# Altium project MAIN BOARD CERES.PrjPcb (part 1 of 2)
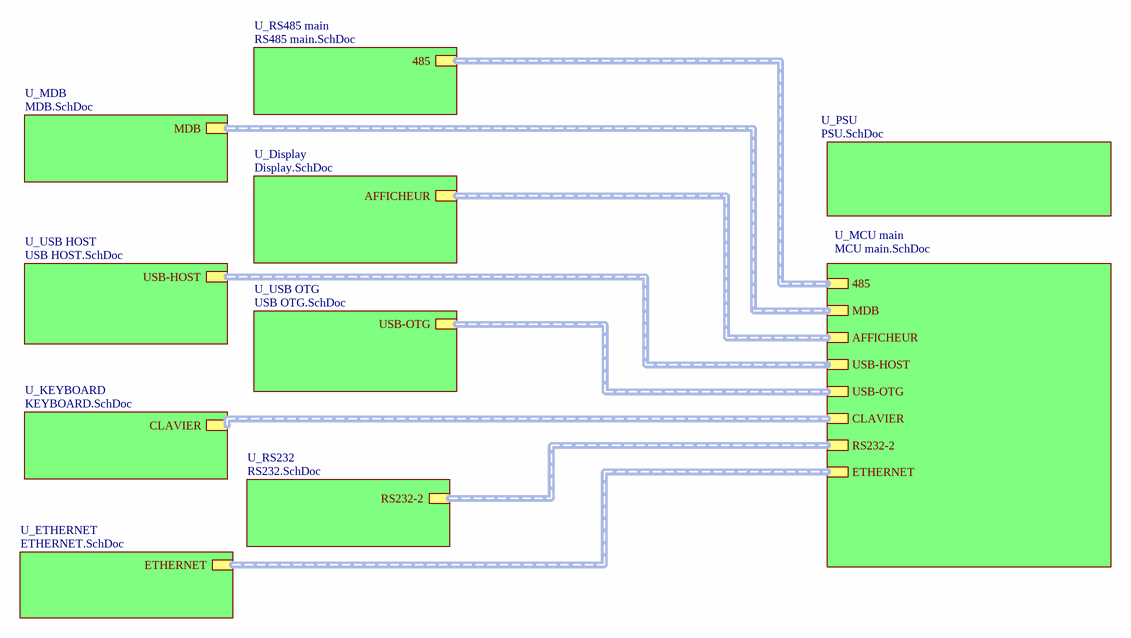
[diagram p0: TOPSHEET.SchDoc]
DrawnBy: Rachid AKKOUCHE; Telephone: +33651604047
11 sheets, 187 parts. Net scope: hierarchical (ports join the sheet entries above them; power ports are global).
Board file: MAIN BOARD CERESV2.PCBDOC
Sheets:
  TOPSHEET.SchDoc
    U_RS485 main = RS485 main.SchDoc
    U_MDB = MDB.SchDoc
    U_KEYBOARD = KEYBOARD.SchDoc
    U_RS232 = RS232.SchDoc
    U_PSU = PSU.SchDoc
    U_USB HOST = USB HOST.SchDoc
    U_USB OTG = USB OTG.SchDoc
    U_Display = Display.SchDoc
    U_MCU main = MCU main.SchDoc
    U_ETHERNET = ETHERNET.SchDoc

## Sheet TOPSHEET.SchDoc: TOP SHEET
size A4; Date: 30 08 2013; Author: Rachid AKKOUCHE; CompanyName: RASoftware; Organization: RASoftware; Address1: 52 J03, rue de la crèche; Address2: 77100 MEAUX; Address3: FRANCE; DocumentNumber: BRA201308301C; Revision: C; SheetNumber: 1; SheetTotal: 11; Telephone: +33651604047; Email: rachid.akkouche@wanadoo.fr; Proprietaire: MDI; Dessinepar: Rachid AKKOUCHE; Verifiepar: -; Time: 19:00

### Sub-sheets
U_Display = Display.SchDoc: AFFICHEUR (harness IO DISPLAY)
U_ETHERNET = ETHERNET.SchDoc: ETHERNET (harness ETHERNET)
U_KEYBOARD = KEYBOARD.SchDoc: CLAVIER (harness KEYBOARD)
U_MCU main = MCU main.SchDoc: USB-HOST (harness USB-HOST), USB-OTG (harness USG-OTG), RS232-2 (harness RS232_2), ETHERNET (harness ETHERNET), AFFICHEUR (harness IO DISPLAY), CLAVIER (harness KEYBOARD), 485 (harness EIA-485), MDB (harness MDB)
U_MDB = MDB.SchDoc: MDB (harness MDB)
U_PSU = PSU.SchDoc: no entries
U_RS232 = RS232.SchDoc: RS232-2 (harness RS232_2)
U_RS485 main = RS485 main.SchDoc: 485 (harness EIA-485)
U_USB HOST = USB HOST.SchDoc: USB-HOST (harness USB-HOST)
U_USB OTG = USB OTG.SchDoc: USB-OTG (harness USG-OTG)

### Buses and harness runs
harness sheet U_Display/AFFICHEUR = sheet U_MCU main/AFFICHEUR
harness sheet U_ETHERNET/ETHERNET = sheet U_MCU main/ETHERNET
harness sheet U_KEYBOARD/CLAVIER = sheet U_MCU main/CLAVIER
harness sheet U_MCU main/485 = sheet U_RS485 main/485
harness sheet U_MCU main/MDB = sheet U_MDB/MDB
harness sheet U_MCU main/RS232-2 = sheet U_RS232/RS232-2
harness sheet U_MCU main/USB-HOST = sheet U_USB HOST/USB-HOST
harness sheet U_MCU main/USB-OTG = sheet U_USB OTG/USB-OTG

### Notes on the sheet
- Ce document est la propriété de
- Project:
- Il ne peut être divulgué sans l'accord écrit de l'un de ses représentants dûment mandaté
- Title:
- Number:
- Date:
- Time:
- Size:
- A4
- Revision:
- Sheet
- of
- 52 J03 rue de la crèche
- Draw by:
- 77100 Meaux

## Sheet RS485 main.SchDoc: RS 485
size A4; Date: 30 08 2013; Author: Rachid AKKOUCHE; CompanyName: MDI; DrawnBy: Rachid AKKOUCHE; Organization: RASoftware; Address1: 52 J03, rue de la crèche; Address2: 77100 MEAUX; Address3: FRANCE; DocumentNumber: BRA201308304C; Revision: C; SheetNumber: 4; SheetTotal: 11; Telephone: +33651604047; Email: rachid.akkouche@wanadoo.fr; Proprietaire: MDI System; Dessinepar: -; Verifiepar: -; Time: 19:00
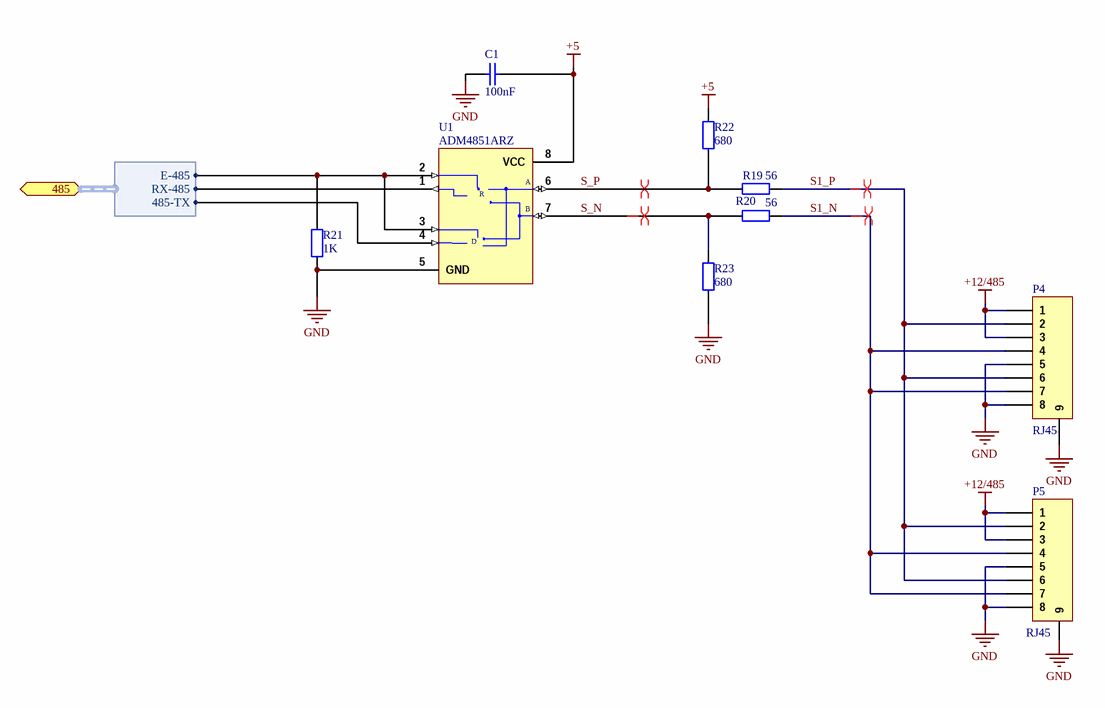
[diagram p1: RS485 main.SchDoc]

### Parts
C1  100nF  [C0805]
P4  RJ45  [MOLEX-RJ45_855135013]
P5  RJ45  [MOLEX-RJ45_855135013]
R19  56  [R0805]
R20  56  [R0805]
R21  1K  [R0805]
R22  680  [R0805]
R23  680  [R0805]
U1  ADM4851ARZ  [SOIC8]

### Ports
485 (harness EIA-485)

### Harnesses
EIA-485: 485-TX, RX-485, E-485

### Nets
+5: C1.1 R22.2 U1.8(VCC)
+12/485: P4.1 P4.3 P5.1 P5.3
GND: C1.2 P4.5 P4.8 P4.9 P5.5 P5.8 R21.1 R23.1 U1.5(GND)
S1_N: P4.4 P4.7 P5.4 P5.7 R20.2  [project net S1_N_4]
S1_P: P4.2 P4.6 P5.2 P5.6 R19.2  [project net S1_P_4]
S_N: R20.1 R23.2 U1.7(B)  [project net S_N_4]
S_P: R19.1 R22.1 U1.6(A)  [project net S_P_4]
NetR21_2: R21.2 U1.2(~{RE}) U1.3(DE) ; port 485.E-485
NetU1_1: U1.1(RO) ; port 485.RX-485
NetU1_4: U1.4(DI) ; port 485.485-TX

Not connected (* = marked no-connect by the designer): P5 9

### Layout directives
differential pair: S1_N_4, S1_P_4, S_N_4, S_P_4

### Notes on the sheet
- Labels drawn without touching a wire or pin: GND
- Ce document est la propriété de
- Project:
- Il ne peut être divulgué sans l'accord écrit de l'un de ses représentants dûment mandaté
- Title:
- Number:
- Date:
- Time:
- Size:
- A4
- Revision:
- Sheet
- of
- 52 J03 rue de la crèche
- Draw by:
- 77100 Meaux
- (in symbol MAX485ESA) R; D

### Library data of the parts
C1 = Cap 0805 100nF: Capacitor; Manufacturer: MULTICOMP; Manufacturer Part Number: MCCA000296; Supplier 1: Farnell; Supplier Part Number 1: 1759167; Pricing 1: 100=0,01, 500=0,008, 1000=0,006, 4000=0,005 (EUR); ComponentLink1URL: http://www.farnell.com/datasheets/1520827.pdf; ComponentLink1Description: http://www.farnell.com/datasheets/1520827.pdf
P4 P5 = Header 8: Header, 8-Pin; Manufacturer: MOLEX; Manufacturer Part Number: 85513-5013; Genre: Embase; Nombre de contacts: 8; Nombre de ports: 1; Catégorie LAN: Cat3; Terminaison du contact: Montage en surface vertical; Plaquage du contact: Or; Matériau du contact: Bronze phosphoreux; Approval Category: UL 94V-0; Couleur: Black; Courant: 1.5; Force diélectrique, Vca: 1000; Inflammabilité: UL94V-0; Largeur (externe): 15.9; Longueur/hauteur: 13; Matière: Glass Filled LCP; Profondeur: 18.8; Résistance d'isolement: 500; Résistance, contact: 20; Température de fonctionnement max..: 80; Température d'utilisation min: -40; Tension c.a.: 125; Supplier 1: Farnell; Supplier Part Number 1: 1345055; RoHS: YES; Pricing 1: 1=0,98, 10=0,92, 50=0,86, 100=0,74 (EUR); Type de connecteur: RJ45; Nombre de positions: 8; Body Plating: Or; Nombre de voies: 8; ComponentLink1URL: http://www.farnell.com/cad/1734187.pdf; ComponentLink1Description: http://www.farnell.com/cad/1734187.pdf; ComponentLink2URL: http://www.farnell.com/datasheets/1733622.pdf; ComponentLink2Description: http://www.farnell.com/datasheets/1733622.pdf
R19 R20 = Resistor 0805 56: Resistor; Manufacturer: MULTICOMP; Manufacturer Part Number: MC01W0805156R; Product Range: MULTICOMP - MC Series; Puissance: 100; Tolérance de résistance: ± 1%; Type de boîtier de résistance: 0805; Type de résistance: Couche épaisse; Coefficient de température: ± 200; Tension: 150; Type de packaging: Full Reel; SVHC: No SVHC (20-Jun-2013); Resistor Mounting: CMS; Supplier 1: Farnell; RoHS: YES; Pricing 1: 5000=0,001 (EUR); Résistance: 56; MSL: (Non Applicable); ComponentLink1URL: http://www.farnell.com/datasheets/1729047.pdf; ComponentLink1Description: http://www.farnell.com/datasheets/1729047.pdf; Supplier Part Number 1: 2129016
R21 = Resistor 0805 1K: Resistor; Manufacturer: MULTICOMP; Manufacturer Part Number: MC0.1W08051%1KFR; Product Range: MULTICOMP - MC Series; Résistance: 1; Puissance: 100; Tolérance de résistance: ± 1%; Type de boîtier de résistance: 0805; Type de résistance: Couche épaisse; Coefficient de température: ± 100; Tension: 150; Type de packaging: Full Reel; Resistor Mounting: CMS; Supplier 1: Farnell; RoHS: YES; Pricing 1: 5000=0,001 (EUR); MSL: MSL 1 - Illimité; ComponentLink1URL: http://www.farnell.com/datasheets/1716700.pdf; ComponentLink1Description: http://www.farnell.com/datasheets/1716700.pdf; Supplier Part Number 1: 2129113
R22 R23 = Resistor 0805 680: Resistor; Manufacturer: MULTICOMP; Manufacturer Part Number: MC01W08051680R; Supplier 1: Farnell; RoHS: YES; Pricing 1: 5000=0,001 (EUR); ComponentLink1URL: http://www.farnell.com/datasheets/1729047.pdf; ComponentLink1Description: http://www.farnell.com/datasheets/1729047.pdf; Supplier Part Number 1: 2129101
U1 = MAX485ESA: Low-Power, Slew-Rate-Limited RS-485/RS-422 Transceiver; Manufacturer: ANALOG DEVICES; Type de driver: Émetteur-récepteur de ligne différentiel; Type d'interface CI: RS422, RS485; Nombre de drivers: 1; Tension, alimentation min.: 4.75; Tension, alimentation max..: 5.25; Type de boîtier CI Driver: NSOIC; Nombre de broches: 8; Température d'utilisation min: -40; Température de fonctionnement max..: 85; SVHC: No SVHC (20-Jun-2013); Supplier 1: Farnell; Supplier Part Number 1: 2313594; Manufacturer Part Number: ADM4851ARZ; RoHS: YES; Pricing 1: 1=1,39, 10=1,13, 100=1,01, 250=0,9, 500=0,79 (EUR); MSL: MSL 1 - Illimité; ComponentLink1URL: http://www.analog.com/static/imported-files/data_sheets/ADM4850_4851_4852_4853_4854_4855_4856_4857.pdf; ComponentLink1Description: http://www.analog.com/static/imported-files/data_sheets/ADM4850_4851_4852_4853_4854_4855_4856_4857.pdf; ComponentLink2URL: http://www.farnell.com/cad/1713403.zip; ComponentLink2Description: http://www.farnell.com/cad/1713403.zip

## Sheet MDB.SchDoc: MDB
size A4; Date: 30 08 2013; Author: Rachid AKKOUCHE; CompanyName: MDI; DrawnBy: Rachid AKKOUCHE; Organization: RASoftware; Address1: 52 J03, rue de la crèche; Address2: 77100 MEAUX; Address3: FRANCE; DocumentNumber: BRA201308303C; Revision: C; SheetNumber: 3; SheetTotal: 11; Telephone: +33651604047; Email: rachid.akkouche@wanadoo.fr; Proprietaire: MDI System; Dessinepar: -; Verifiepar: -; Time: 19:00
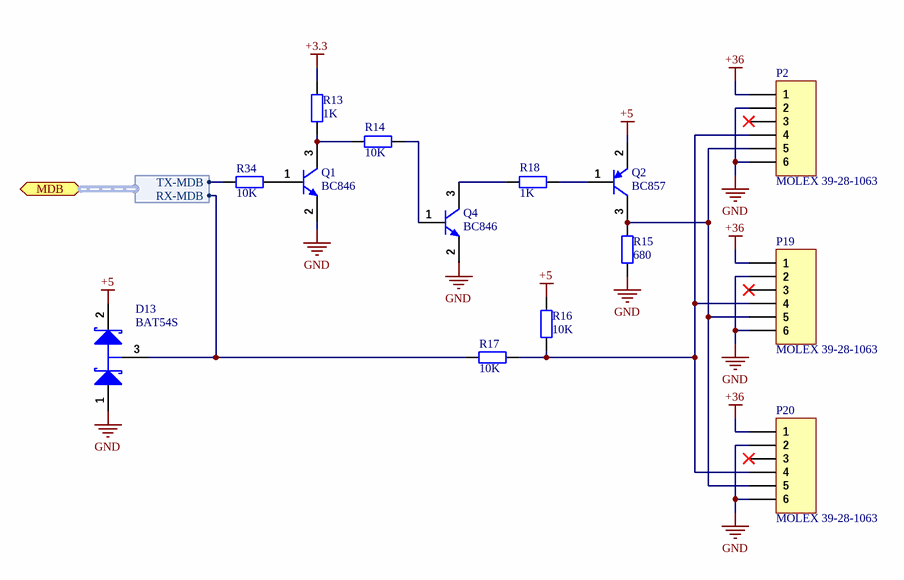
[diagram p2: MDB.SchDoc]

### Parts
D13  BAT54S  [SOT23]
P2  MOLEX 39-28-1063  [MOLEX 39-28-1063]
P19  MOLEX 39-28-1063  [MOLEX 39-28-1063]
P20  MOLEX 39-28-1063  [MOLEX 39-28-1063]
Q1  BC846  [SOT-23]
Q2  BC857  [SOT-23]
Q4  BC846  [SOT-23]
R13  1K  [R0805]
R14  10K  [R0805]
R15  680  [R0805]
R16  10K  [R0805]
R17  10K  [R0805]
R18  1K  [R0805]
R34  10K  [R0805]

### Ports
MDB (harness MDB)

### Harnesses
MDB: TX-MDB, RX-MDB

### Nets
+3.3: R13.2
+5: D13.2(K) Q2.2(E) R16.2
+36: P2.1 P19.1 P20.1
GND: D13.1(A) P2.2 P2.6 P19.2 P19.6 P20.2 P20.6 Q1.2(E) Q4.2(E) R15.1
NetD13_3: D13.3(C) R17.2 ; port MDB.RX-MDB
NetP2_4: P2.4 P19.4 P20.4 R16.1 R17.1
NetP2_5: P2.5 P19.5 P20.5 Q2.3(C) R15.2
NetQ1_1: Q1.1(B) R34.1
NetQ1_3: Q1.3(C) R13.1 R14.2
NetQ2_1: Q2.1(B) R18.1
NetQ4_1: Q4.1(B) R14.1
NetQ4_3: Q4.3(C) R18.2
NetR34_2: R34.2 ; port MDB.TX-MDB

Not connected (* = marked no-connect by the designer): P2 3*; P19 3*; P20 3*

### Notes on the sheet
- Ce document est la propriété de
- Project:
- Il ne peut être divulgué sans l'accord écrit de l'un de ses représentants dûment mandaté
- Title:
- Number:
- Date:
- Time:
- Size:
- A4
- Revision:
- Sheet
- of
- 52 J03 rue de la crèche
- Draw by:
- 77100 Meaux

### Library data of the parts
D13 = BAT54S: Schottky Barrier Double Diode; Manufacturer: MULTICOMP; Courant, If moy.: 200; Tension, Vrrm: 30; Tension, Vf max..: 400; Temps trr max.: 5; Courant, Ifs max.: 600; Type de boîtier diode: SOT-23; Nombre de broches: 3; SVHC: No SVHC (19-Dec-2012); Configuration diode: Dual Series; Température, Tj max..: 150; Type de terminaison: SMD; Température d'utilisation min: -55; Courant, If, Vf: 10; Courant, Ir, max..: 2; Marquage, CMS: L44; Température de fonctionnement: -55°C à +150; Supplier 1: Farnell; Supplier Part Number 1: 1621835; Manufacturer Part Number: BAT54S; RoHS: YES; Stock 1: 52055; Pricing 1: 10=0,102, 250=0,074, 1000=0,06, 3000=0,053 (EUR); Diode Type: Schottky; Type de boîtier: SOT-23; courant Ifsm: 600; ComponentLink1URL: http://www.farnell.com/datasheets/1317753.pdf; ComponentLink1Description: http://www.farnell.com/datasheets/1317753.pdf; Température de fonctionnement max..: 150
P2 P19 P20 = Header 6: Connecteur MDB; Supplier 1: Farnell; Supplier Part Number 1: 9732101; Manufacturer: MOLEX; Manufacturer Part Number: 39-28-1063; RoHS: YES; Pricing 1: 1=0,66, 100=0,62, 250=0,58, 500=0,52, 1000=0,46 (EUR); ComponentLink1URL: http://www.molex.com/pdm_docs/sd/039310028_sd.pdf; ComponentLink1Description: http://www.molex.com/pdm_docs/sd/039310028_sd.pdf; ComponentLink2URL: http://www.youtube.com/watch?v=pjOsgpqyzYE; ComponentLink2Description: http://www.youtube.com/watch?v=pjOsgpqyzYE; ComponentLink3URL: http://www.farnell.com/datasheets/1729684.pdf; ComponentLink3Description: http://www.farnell.com/datasheets/1729684.pdf
Q1 Q4 = BC846B: NPN General-purpose Transistor; Manufacturer: NXP; Tension, Vceo: 65; Dissipation de puissance Pd: 250; Courant de collecteur DC: 100; Gain en courant DC hFE: 110; Température d'utilisation min: -65; Température de fonctionnement max..: 150; Nombre de broches: 3; SVHC: No SVHC (19-Dec-2012); Courant, Ic (hfe): 2; FB max..: 10; Gain Bande-passante ft, typ.: 300; Hfe, typ.: 125; Marquage, CMS: 1; Température de fonctionnement: -65°C à +150; Tension, Vcbo: 80; Tension, Vce sat max..: 200; Type de terminaison: SMD; Supplier 1: Farnell; Supplier Part Number 1: 1081227; Manufacturer Part Number: BC846; RoHS: YES; Pricing 1: 10=0,02, 100=0,016, 1000=0,015, 3000=0,013 (EUR); Polarité transistor: NPN; Type de boîtier de transistor: SOT-23; Courant Ic max..: 100; Courant, Ic max.. permanent a: 100; Hfe, min.: 110; Marquage composant: BC846; Nombre de transistors: 1; Puissance, Ptot: 250; Type de boîtier: SOT-23; ft, min.: 100; ComponentLink1URL: http://www.farnell.com/datasheets/1581369.pdf; ComponentLink1Description: http://www.farnell.com/datasheets/1581369.pdf
Q2 = PMBT2907A: PNP Switching Transistor; Manufacturer: NXP; Supplier 1: Farnell; Supplier Part Number 1: 1081244; Manufacturer Part Number: BC857; RoHS: YES; Stock 1: 28017; Pricing 1: 10=0,023, 100=0,021, 1000=0,019, 3000=0,017 (EUR); ComponentLink1URL: http://www.nxp.com/documents/data_sheet/BC856_BC857_BC858.pdf; ComponentLink1Description: http://www.nxp.com/documents/data_sheet/BC856_BC857_BC858.pdf
R13 R18 = Resistor 0805 1K: as R21 on sheet RS485 main; Supplier 1: Farnell; RoHS: YES; Pricing 1: 5000=0,001 (EUR); MSL: MSL 1 - Illimité; ComponentLink1URL: http://www.farnell.com/datasheets/1716700.pdf; ComponentLink1Description: http://www.farnell.com/datasheets/1716700.pdf; Supplier Part Number 1: 2129113
R14 R16 R17 R34 = Resistor 0805 10K: Resistor; Manufacturer: MULTICOMP; Manufacturer Part Number: MC0.1W08051%10KFR; Product Range: MULTICOMP - MC Series; Résistance: 10; Puissance: 100; Tolérance de résistance: ± 1%; Type de boîtier de résistance: 0805; Type de résistance: Couche épaisse; Coefficient de température: ± 100; Tension: 150; Type de packaging: Full Reel; Resistor Mounting: CMS; Supplier 1: Farnell; RoHS: YES; Pricing 1: 5000=0,001 (EUR); MSL: MSL 1 - Illimité; ComponentLink1URL: http://www.farnell.com/datasheets/1716700.pdf; ComponentLink1Description: http://www.farnell.com/datasheets/1716700.pdf; Supplier Part Number 1: 2129195
R15 = Resistor 0805 680: as R22 on sheet RS485 main; Supplier 1: Farnell; RoHS: YES; Pricing 1: 5000=0,001 (EUR); ComponentLink1URL: http://www.farnell.com/datasheets/1729047.pdf; ComponentLink1Description: http://www.farnell.com/datasheets/1729047.pdf; Supplier Part Number 1: 2129101

## Sheet KEYBOARD.SchDoc: KEYBOARD
size A4; Date: 30 08 2013; Author: Rachid AKKOUCHE; CompanyName: MDI; DrawnBy: Rachid AKKOUCHE; Organization: RASoftware; Address1: 52 J03, rue de la crèche; Address2: 77100 MEAUX; Address3: FRANCE; DocumentNumber: BRA201308306C; Revision: C; SheetNumber: 6; SheetTotal: 11; Telephone: +33651604047; Email: rachid.akkouche@wanadoo.fr; Proprietaire: MDI System; Dessinepar: -; Verifiepar: -; Time: 19:00
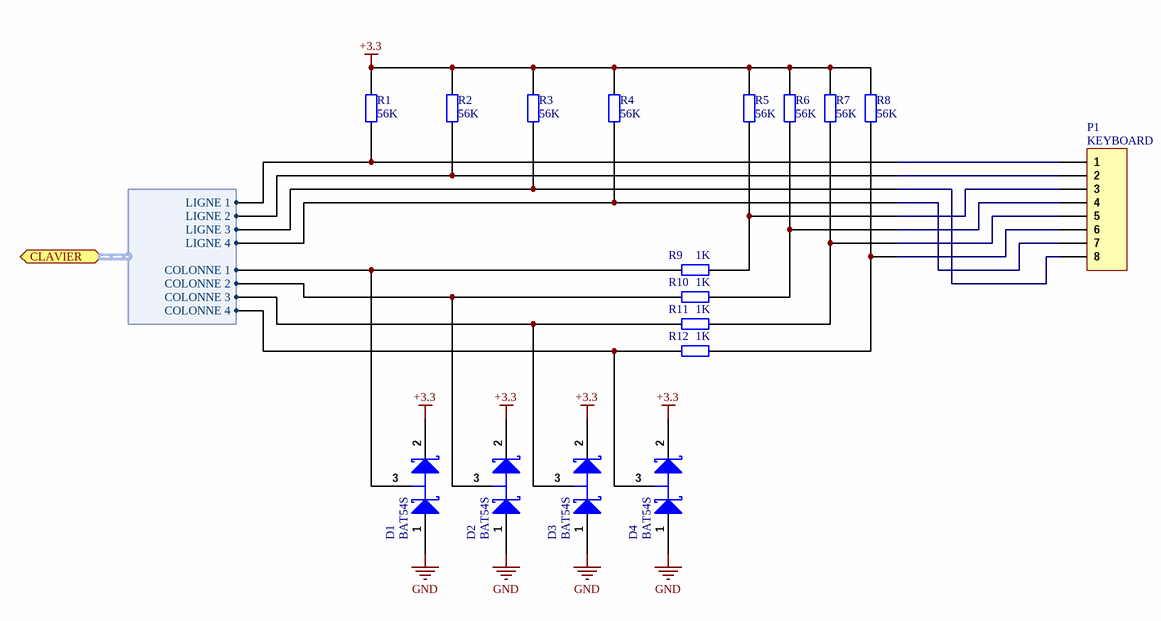
[diagram p3: KEYBOARD.SchDoc]

### Parts
D1  BAT54S  [SOT-23]
D2  BAT54S  [SOT-23]
D3  BAT54S  [SOT-23]
D4  BAT54S  [SOT-23]
P1  KEYBOARD  [M20_1X8]
R1  56K  [R0805]
R2  56K  [R0805]
R3  56K  [R0805]
R4  56K  [R0805]
R5  56K  [R0805]
R6  56K  [R0805]
R7  56K  [R0805]
R8  56K  [R0805]
R9  1K  [R0805]
R10  1K  [R0805]
R11  1K  [R0805]
R12  1K  [R0805]

### Ports
CLAVIER (harness KEYBOARD)

### Harnesses
KEYBOARD: COLONNE 1, COLONNE 2, COLONNE 3, COLONNE 4, LIGNE 1, LIGNE 2, LIGNE 3, LIGNE 4

### Nets
+3.3: D1.2(K) D2.2(K) D3.2(K) D4.2(K) R1.1 R2.1 R3.1 R4.1 R5.1 R6.1 R7.1 R8.1
GND: D1.1(A) D2.1(A) D3.1(A) D4.1(A)
NetD1_3: D1.3(C) R9.1 ; port CLAVIER.COLONNE 1
NetD2_3: D2.3(C) R10.1 ; port CLAVIER.COLONNE 2
NetD3_3: D3.3(C) R11.1 ; port CLAVIER.COLONNE 3
NetD4_3: D4.3(C) R12.1 ; port CLAVIER.COLONNE 4
NetP1_1: P1.1 R1.2 ; port CLAVIER.LIGNE 1
NetP1_2: P1.2 R2.2 ; port CLAVIER.LIGNE 2
NetP1_3: P1.3 R5.2 R9.2
NetP1_4: P1.4 R6.2 R10.2
NetP1_5: P1.5 R7.2 R11.2
NetP1_6: P1.6 R8.2 R12.2
NetP1_7: P1.7 R4.2 ; port CLAVIER.LIGNE 4
NetP1_8: P1.8 R3.2 ; port CLAVIER.LIGNE 3

### Notes on the sheet
- Ce document est la propriété de
- Project:
- Il ne peut être divulgué sans l'accord écrit de l'un de ses représentants dûment mandaté
- Title:
- Number:
- Date:
- Time:
- Size:
- A4
- Revision:
- Sheet
- of
- 52 J03 rue de la crèche
- Draw by:
- 77100 Meaux

### Library data of the parts
D1-D4 = BAT54S: Schottky Barrier Double Diode; Manufacturer: MULTICOMP; Published: 17-Sep-2003; LatestRevisionDate: 12-Dec-2006; LatestRevisionNote: IPC-7351 Footprint Added.; DatasheetVersion: 4-Mar-2002; PackageVersion: May-1999; PackageReference: SOT23; Publisher: Altium Limited; PackageDescription: 3-Pin SOT-23 Package 0.95 mm Pitch, 2.3 mm Lead Span; ComponentLink1Description: Manufacturer Link; ComponentLink1URL: http://www.semiconductors.philips.com/; ComponentLink2Description: Datasheet; ComponentLink2URL: http://www.semiconductors.philips.com/acrobat/datasheets/BAT54_SERIES_4.pdf; Supplier 1: Farnell; Supplier Part Number 1: 1621835; Manufacturer Part Number: BAT54S; RoHS: YES; Stock 1: 51548; Pricing 1: 10=0,102, 250=0,074, 1000=0,06, 3000=0,053 (EUR); ComponentLink3URL: http://www.farnell.com/datasheets/1317753.pdf; ComponentLink3Description: http://www.farnell.com/datasheets/1317753.pdf
P1 = Header 8: Header, 8-Pin; Manufacturer: HARWIN; Manufacturer Part Number: M20-8770842; LatestRevisionDate: 17-Jul-2002; LatestRevisionNote: Re-released for DXP Platform.; Publisher: Altium Limited; Supplier 1: Farnell; Supplier Part Number 1: 1517385; RoHS: YES; Pricing 1: 10=0,9, 20=0,86, 50=0,8, 100=0,77, 250=0,75, 500=0,71 (EUR); ComponentLink1URL: http://www.farnell.com/datasheets/1089525.pdf; ComponentLink1Description: http://www.farnell.com/datasheets/1089525.pdf; ComponentLink2URL: http://www.farnell.com/datasheets/5481.pdf; ComponentLink2Description: http://www.farnell.com/datasheets/5481.pdf
R1-R8 = Resistor 0805 56K: Resistor; Manufacturer: MULTICOMP; Manufacturer Part Number: MC0.1W08051%56KFR; Product Range: MULTICOMP - MC Series; Résistance: 56; Puissance: 100; Tolérance de résistance: ± 1%; Type de boîtier de résistance: 0805; Type de résistance: Couche épaisse; Coefficient de température: ± 100; Tension: 150; Type de packaging: Full Reel; Resistor Mounting: CMS; Resistor Terminals: (Non Disponible); Supplier 1: Farnell; RoHS: YES; Pricing 1: 5000=0,001 (EUR); MSL: (Non Applicable); ComponentLink1URL: http://www.farnell.com/datasheets/1716700.pdf; ComponentLink1Description: http://www.farnell.com/datasheets/1716700.pdf; Supplier Part Number 1: 2129258
R9-R12 = Res2: Resistor; Manufacturer: MULTICOMP; Manufacturer Part Number: MC0.1W08051%1KFR; Product Range: MULTICOMP - MC Series; Résistance: 1; Puissance: 100; Tolérance de résistance: ± 1%; Type de boîtier de résistance: 0805; Type de résistance: Couche épaisse; Coefficient de température: ± 100; Tension: 150; Type de packaging: Full Reel; Resistor Mounting: CMS; Supplier 1: Farnell; Supplier Part Number 1: 2129113; RoHS: YES; Pricing 1: 5000=0,001 (EUR); MSL: MSL 1 - Illimité; ComponentLink1URL: http://www.farnell.com/datasheets/1636796.pdf; ComponentLink1Description: http://www.farnell.com/datasheets/1636796.pdf

## Sheet RS232.SchDoc: RS-232
size A4; Date: 30 08 2013; Author: Rachid AKKOUCHE; CompanyName: MDI; DrawnBy: Rachid AKKOUCHE; Address1: 52 J03 rue de la crèche; Address2: 77100 MEAUX; Address3: FRANCE; DocumentNumber: BRA201308305C; Revision: C; SheetNumber: 5; SheetTotal: 11; Telephone: +33651604047; Email: rachid.akkouche@wanadoo.fr; Proprietaire: MDI System; Dessinepar: -; Verifiepar: -; Time: 19:00
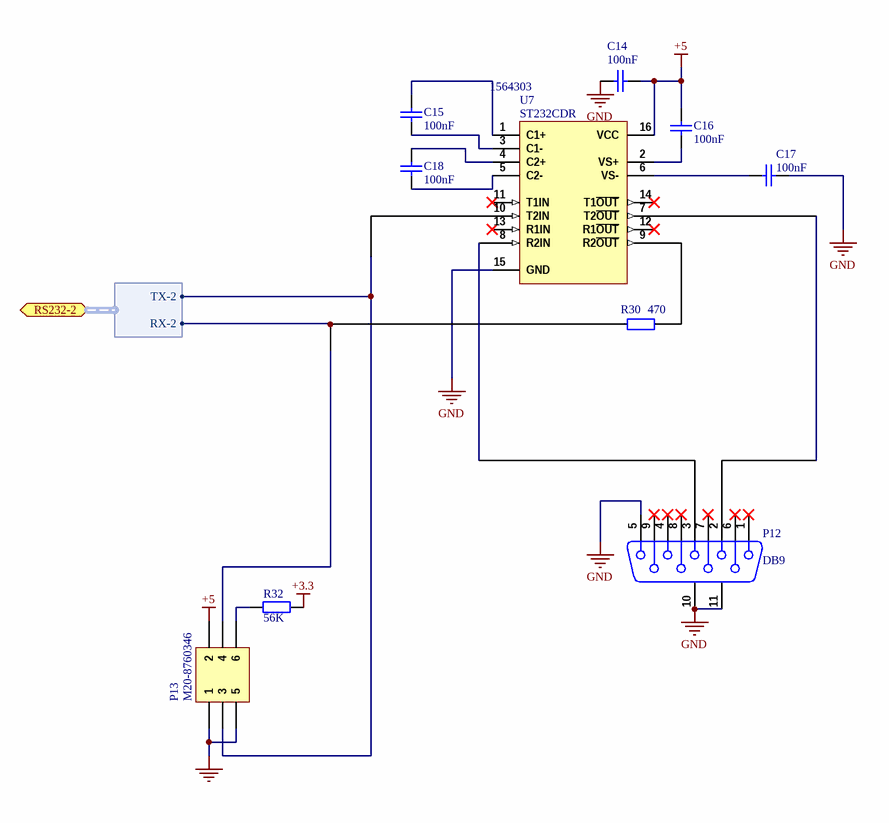
[diagram p4: RS232.SchDoc]

### Parts
C14  100nF  [C0805]
C15  100nF  [C0805]
C16  100nF  [C0805]
C17  100nF  [C0805]
C18  100nF  [C0805]
P12  DB9  [SUBD9_F_V]
P13  M20-8760346  [M20-2X3]
R30  470  [R0805]
R32  56K  [R0805]
U7  ST232CDR  Supplier Part Number 1: 1564303  [SO-16]

### Ports
RS232-2 (harness RS232_2)

### Harnesses
RS232_2: TX-2, RX-2

### Nets
+3.3: R32.2
+5: C14.1 C16.2 P13.2 U7.16(VCC)
GND: C14.2 C17.1 P12.5 P12.10(MH1) P12.11(MH2) P13.1 P13.5 U7.15(GND)
NetC15_1: C15.1 U7.3(C1-)
NetC15_2: C15.2 U7.1(C1+)
NetC16_1: C16.1 U7.2(VS+)
NetC17_2: C17.2 U7.6(VS-)
NetC18_1: C18.1 U7.5(C2-)
NetC18_2: C18.2 U7.4(C2+)
NetP12_2: P12.2 U7.7(T2~{OUT})
NetP12_3: P12.3 U7.8(R2IN)
NetP13_3: P13.3 U7.10(T2IN) ; port RS232-2.TX-2
NetP13_4: P13.4 R30.1 ; port RS232-2.RX-2
NetP13_6: P13.6 R32.1
NetR30_2: R30.2 U7.9(R2~{OUT})

Not connected (* = marked no-connect by the designer): P12 1* 4* 6* 7* 8* 9*; U7 11(T1IN)* 12(R1~{OUT})* 13(R1IN)* 14(T1~{OUT})*

### Notes on the sheet
- Ce document est la propriété de
- Project:
- Il ne peut être divulgué sans l'accord écrit de l'un de ses représentants dûment mandaté
- Title:
- Number:
- Date:
- Time:
- Size:
- A4
- Revision:
- Sheet
- of
- 52 J03 rue de la crèche
- Draw by:
- 77100 Meaux

### Library data of the parts
C14-C18 = Cap: Capacitor; Manufacturer: MULTICOMP; Manufacturer Part Number: MCCA000296; Supplier 1: Farnell; Supplier Part Number 1: 1759167; Stock 1: 225269; Pricing 1: 100=0,01, 500=0,008, 1000=0,006, 4000=0,005 (EUR); ComponentLink1URL: http://www.farnell.com/datasheets/1520827.pdf; ComponentLink1Description: http://www.farnell.com/datasheets/1520827.pdf
P12 = D Connector 9: Receptacle Assembly, 9 Position, Right Angle; Manufacturer: TE CONNECTIVITY / AMP; Manufacturer Part Number: 2-338313-2; Type de connecteur: Sub-D; Série: HDP-20; Genre: Embase; Nombre de contacts: 9; Nombre de rangées: 2; Plaquage du contact: Or; Matériau du contact: Bronze phosphoreux; Méthode de terminaison: A souder; Supplier 1: Farnell; Supplier Part Number 1: 1772804; RoHS: YES; Stock 1: 500; Pricing 1: 10=5,54, 50=5,31, 100=5,09, 250=4,63, 500=4,25 (EUR); ComponentLink1URL: http://www.tycoelectronics.com/commerce/DocumentDelivery/DDEController?Action=srchrtrv&DocNm=2-338313-2&DocType=Customer+View+Model&DocLang=English; ComponentLink1Description: http://www.tycoelectronics.com/commerce/DocumentDelivery/DDEController?Action=srchrtrv&DocNm=2-338313-2&DocType=Customer+View+Model&DocLang=English; ComponentLink2URL: http://www.farnell.com/cad/1599981.pdf; ComponentLink2Description: http://www.farnell.com/cad/1599981.pdf; ComponentLink3URL: http://www.farnell.com/datasheets/1643129.pdf; ComponentLink3Description: http://www.farnell.com/datasheets/1643129.pdf
P13 = Header 3X2: Header, 3-Pin, Dual row; Manufacturer: Harwin; Mounting Angle: Vertical; Pitch: 2.54 mm; Number of Positions / Contacts: 6; Supplier 1: Mouser; Supplier Part Number 1: 855-M20-8760346; Manufacturer Part Number: M20-8760346; RoHS: RoHS Compliant; Category: Headers & Wire Housings; Stock 1: 0; Pricing 1: 2250=0.285, 2500=0.213, 10000=0.211 (AUD); Contact Plating: Gold; Number of Rows: 2; Packaging: Bag; Series: M20-876; Termination Style: Solder; Mounting Style: SMD/SMT; Product Category: 2.54mm M20 SMT Connectors; Product Type: Headers - Pin Strip; Standard Pack Qty: 1000; RoHS - Mouser: Y; Minimum Order Quantity: 2250; Reeling: False; ComponentLink1URL: http://harwin.com/include/downloads/drawings/M20-876.PDF; ComponentLink1Description: http://harwin.com/include/downloads/drawings/M20-876.PDF
R30 = Res2: Resistor; Manufacturer: MULTICOMP; Manufacturer Part Number: MC0.1W08051%470RFR; Supplier 1: Farnell; Supplier Part Number 1: 2129087; RoHS: YES; Stock 1: 364995; Pricing 1: 5000=0,001 (EUR); ComponentLink1URL: http://www.farnell.com/datasheets/1636796.pdf; ComponentLink1Description: http://www.farnell.com/datasheets/1636796.pdf
R32 = Resistor 0805 56K: as R1 on sheet KEYBOARD; Supplier 1: Farnell; RoHS: YES; Pricing 1: 5000=0,001 (EUR); MSL: (Non Applicable); ComponentLink1URL: http://www.farnell.com/datasheets/1716700.pdf; ComponentLink1Description: http://www.farnell.com/datasheets/1716700.pdf; Supplier Part Number 1: 2129258
U7 = MAX232D: Dual EIA-232 Driver/Receiver; Manufacturer: STMICROELECTRONICS; Type de driver: Driver / Récepteur de ligne; Type d'interface CI: RS232; Nombre de drivers: 2; Tension, alimentation min.: 4.5; Tension, alimentation max..: 5.5; Type de boîtier CI Driver: SOIC; Nombre de broches: 16; Température d'utilisation min: 0; Température de fonctionnement max..: 70; SVHC: No SVHC (19-Dec-2012); Courant, alimentation: 5; Gamme de tension d'alimentation: 4.5V à 5.5; Interface: RS232, V.28; Racine de la référence: 232; Taux de transfert: 220; Technologie: Transceivers; Temps de propagation: 0.3; Température de fonctionnement: 0°C à +70; Type de terminaison: SMD; Supplier 1: Farnell; Manufacturer Part Number: ST232CDR; RoHS: YES; Stock 1: 7532; Pricing 1: 1=0,8, 10=0,75, 100=0,71, 250=0,61, 500=0,56 (EUR); MSL: MSL 1 - Illimité; Nombre de récepteurs: 2; Type de boîtier: SOIC; ComponentLink1URL: http://www.st.com/web/en/resource/technical/document/datasheet/CD00001703.pdf; ComponentLink1Description: http://www.st.com/web/en/resource/technical/document/datasheet/CD00001703.pdf; ComponentLink2URL: http://www.farnell.com/cad/1725166.zip; ComponentLink2Description: http://www.farnell.com/cad/1725166.zip

## Sheet PSU.SchDoc: POWER SUPPLY
size A4; Date: 30 08 2013; Author: Rachid AKKOUCHE; CompanyName: MDI; DrawnBy: Rachid AKKOUCHE; Engineer: Rachid AKKOUCHE; Organization: RASoftware; Address1: 52 J03, rue de la crèche; Address2: 77100 MEAUX; Address3: FRANCE; DocumentNumber: BRA201308308C; Revision: C; SheetNumber: 8; SheetTotal: 11; Telephone: +33651604047; Email: rachid.akkouche@wanadoo.fr; Proprietaire: MDI System; Dessinepar: -; Verifiepar: -; Time: 19:00
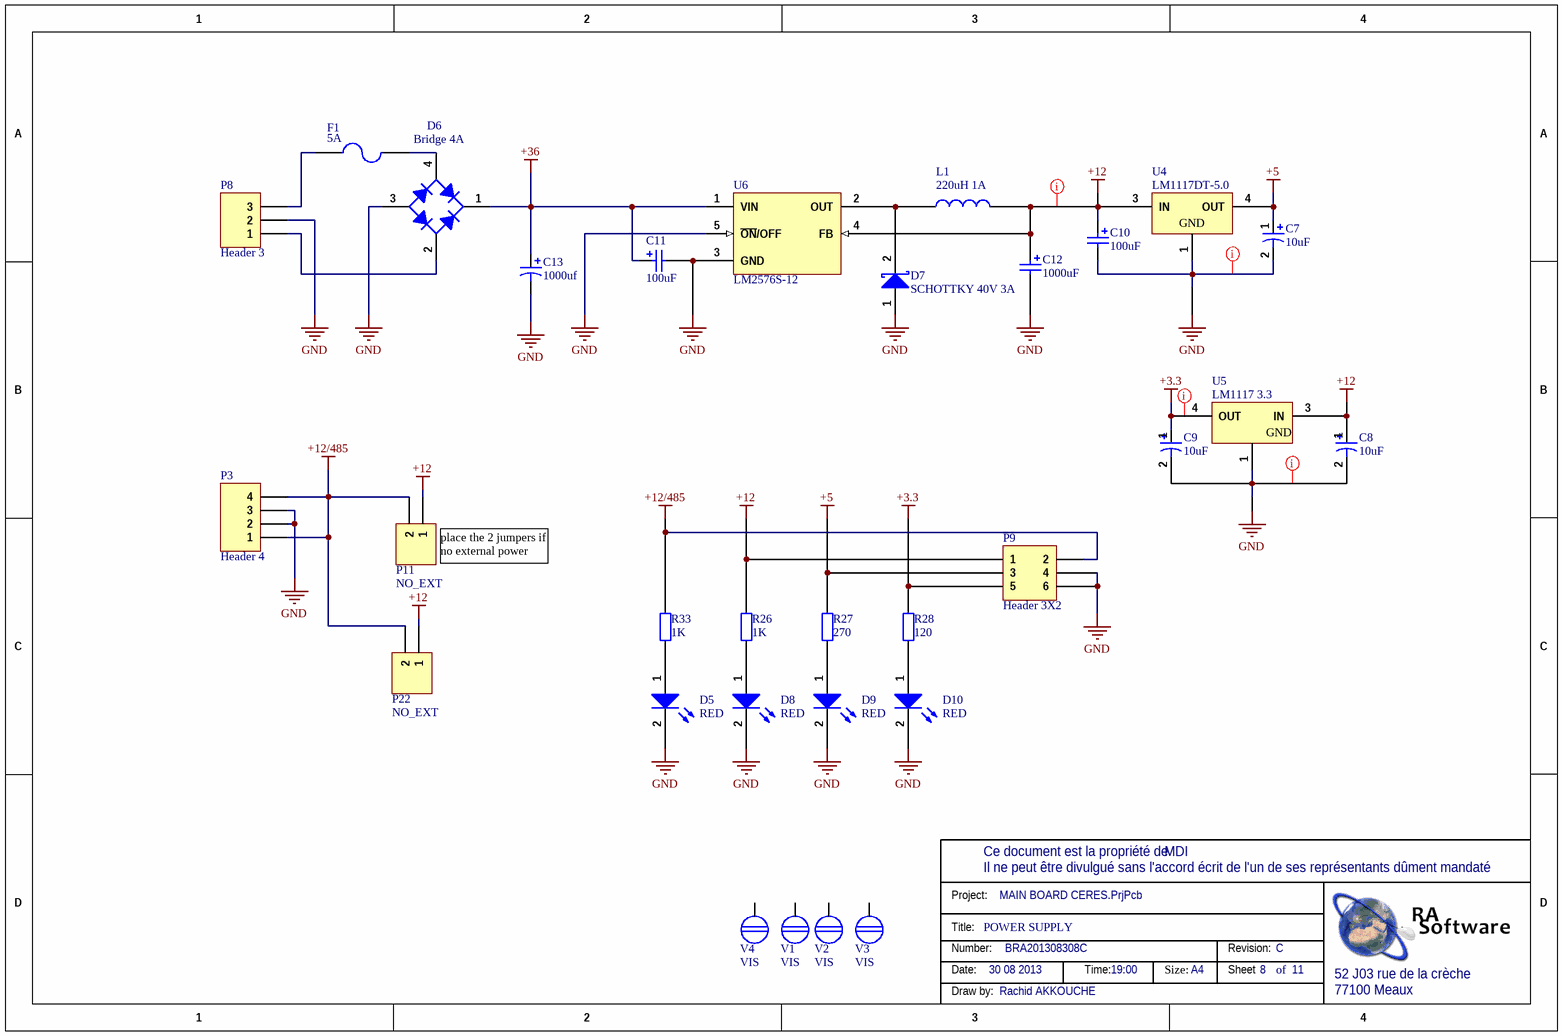
[diagram p5: PSU.SchDoc]

### Parts
C7  10uF  [KEMET_4]
C8  10uF  [KEMET_4]
C9  10uF  [KEMET_4]
C10  100uF  [Kemet_63]
C11  100uF  [Kemet_63]
C12  1000uF  [KEMET_10]
C13  1000uf  [Capa Panasonic size J16]
D5  Couleur: RED  [0603-LEDR]  (hidden comment: HSMH-C190)
D6  Bridge 4A  [Pont GBU]
D7  SCHOTTKY 40V 3A  [DO220AA]
D8  Couleur: RED  [0603-LEDR]  (hidden comment: HSMH-C190)
D9  Couleur: RED  [0603-LEDR]  (hidden comment: HSMH-C190)
D10  Couleur: RED  [0603-LEDR]  (hidden comment: HSMH-C190)
F1  5A  [FUS5X20]
L1  220uH 1A  [IND-1422435C]
P3  Header 4  [CO4P508]
P8  Header 3  [CO3P508]
P9  Header 3X2  [M20-2X3]
P11  NO_EXT  [M20_1X2]
P22  NO_EXT  [M20_1X2]
R26  1K  [R0805]
R27  270  [R0805]
R28  120  [R0805]
R33  1K  [R0805]
U4  LM1117DT-5.0  [SOT223]
U5  LM1117 3.3  [TO252]
U6  LM2576S-12  [TO263-5]
V1  VIS  [VIS42]
V2  VIS  [VIS42]
V3  VIS  [VIS42]
V4  VIS  [VIS42]

### Nets
+3.3: C9.1 P9.5 R28.2 U5.4(OUT)
+5: C7.1 P9.3 R27.2 U4.4(OUT)
+12: C8.1 C10.1 C12.1 L1.2 P9.1 P11.1 P22.1 R26.2 U4.3(IN) U5.3(IN) U6.4(FB)
+12/485: P3.1 P3.4 P9.2 P11.2 P22.2 R33.2
+36: C11.1 C13.1 D6.1(K) U6.1(VIN)
GND: C7.2 C8.2 C9.2 C10.2 C11.2 C12.2 C13.2 D5.2(K) D6.3(A) D7.1(A) D8.2(K) D9.2(K) D10.2(K) P3.2 P3.3 P8.2 P9.4 P9.6 U4.1(GND) U5.1(GND) U6.3(GND) U6.5(~{ON}/OFF)
NetD5_1: D5.1(A) R33.1
NetD6_2: D6.2(C) P8.1
NetD6_4: D6.4(C) F1.2
NetD7_2: D7.2(K) L1.1 U6.2(OUT)
NetD8_1: D8.1(A) R26.1
NetD9_1: D9.1(A) R27.1
NetD10_1: D10.1(A) R28.1
NetF1_1: F1.1 P8.3

Not connected (* = marked no-connect by the designer): V1 1; V2 1; V3 1; V4 1

### Layout directives
rule Width Constraint [Pref Width = 0.55mm    Min Width = 0.254mm    Max Width = 2mm]: +3.3, +12, GND

### Notes on the sheet
- (near P11) place the 2 jumpers if no external power
- Ce document est la propriété de
- Project:
- Il ne peut être divulgué sans l'accord écrit de l'un de ses représentants dûment mandaté
- Title:
- Number:
- Date:
- Time:
- Size:
- A4
- Revision:
- Sheet
- of
- 52 J03 rue de la crèche
- Draw by:
- 77100 Meaux

### Library data of the parts
C7-C9 = Cap Pol1: Polarized Capacitor; Manufacturer: KEMET; Manufacturer Part Number: EXV106M025A9BAA; Supplier 1: Farnell; Supplier Part Number 1: 2069174; RoHS: YES; Pricing 1: 10=0,111, 100=0,085, 500=0,074, 1000=0,07, 5000=0,066 (EUR); ComponentLink1URL: http://www.farnell.com/datasheets/1500293.pdf; ComponentLink1Description: http://www.farnell.com/datasheets/1500293.pdf
C10 C11 = Cap Pol 100uF: Polarized Capacitor; Manufacturer: EPCOS; Manufacturer Part Number: B41142A4107M; Product Range: EPCOS - B41142 Series; Capacité: 100; Tolérance de capacité: ± 20%; Tension: 16; Type de boîtier de condensateur: Radial Can - SMD; Diamètre: 6.3; Résistance, ESR: 0.16; Hauteur: 7.7; Courant d'ondulation c.a.: 300; Type de packaging: Cut Tape; Durée de vie @ température: 2000 heures @ 105; Température d'utilisation min: -55; Température de fonctionnement max..: 105; SVHC: No SVHC (19-Dec-2012); Impédance: 0.26; Température de fonctionnement: -55°C à +105; Température, ESR: 20; Type de boîtier: CMS; Supplier 1: Farnell; RoHS: YES; Pricing 1: 10=0,123, 50=0,095, 100=0,078, 250=0,07, 1000=0,062 (EUR); Courant d'ondulation c.a. à  100Hz: 300; Fréquence, impédance: 100; Longueur/hauteur: 7.7; Température, courant ondulatoire: 105; Température, impédance: 20; ComponentLink1URL: http://www.epcos.com/inf/20/30/db/alu_x/B41142.pdf; ComponentLink1Description: http://www.epcos.com/inf/20/30/db/alu_x/B41142.pdf; Supplier Part Number 1: 1735328
C12 = Cap Pol 1000uF: Polarized Capacitor; Manufacturer: PANASONIC; Manufacturer Part Number: EEEFT1C102AP; Product Range: PANASONIC - FT Series; Capacité: 1000; Tolérance de capacité: ± 20%; Tension: 16; Type de boîtier de condensateur: Radial Can - SMD; Diamètre: 10; Résistance, ESR: 0.06; Hauteur: 10.2; Courant d'ondulation c.a.: 1190; Type de packaging: Cut Tape; Durée de vie @ température: 2000 heures @ 105; Température d'utilisation min: -55; Température de fonctionnement max..: 105; Température de fonctionnement: -55°C à +105; Supplier 1: Farnell; Supplier Part Number 1: 2065974; RoHS: YES; Pricing 1: 5=1,16, 50=0,76, 100=0,49, 500=0,45, 1000=0,44 (EUR); ComponentLink1URL: http://industrial.panasonic.com/www-data/pdf/ABA0000/ABA0000CE135.pdf; ComponentLink1Description: http://industrial.panasonic.com/www-data/pdf/ABA0000/ABA0000CE135.pdf; ComponentLink2URL: http://www.farnell.com/cad/1703921.zip; ComponentLink2Description: http://www.farnell.com/cad/1703921.zip
C13 = Cap Pol1: Polarized Capacitor (Radial); Manufacturer: PANASONIC; Manufacturer Part Number: EEVFK1H102M; Supplier 1: Farnell; Supplier Part Number 1: 9695982; RoHS: YES; Pricing 1: 1=1,91, 50=1,58, 100=0,82, 500=0,79, 1000=0,77 (EUR); ComponentLink1URL: http://industrial.panasonic.com/www-data/pdf/ABA0000/ABA0000CE120.pdf; ComponentLink1Description: http://industrial.panasonic.com/www-data/pdf/ABA0000/ABA0000CE120.pdf; ComponentLink2URL: http://www.farnell.com/cad/1703914.zip; ComponentLink2Description: http://www.farnell.com/cad/1703914.zip
D5 D8-D10 = HSMH-C190: Surface Mount Chip LED, Red; Manufacturer: AVAGO TECHNOLOGIES; Manufacturer Part Number: HSMH-C190.; Taille de lampe: 0.8mm x 1; Couleur de LED: Rouge; Intensité lumineuse: 17; Angle, vision: 170°; Courant, direct, If: 20; Tension, direct à  If: 1.8; Montage LED: CMS; Forme de lentille: Rectangulaire; Longueur d'onde typ.: 626; SVHC: No SVHC (19-Dec-2012); Dissipation de puissance: 65; Intensité lumineuse min. à  If: 2.8; Intensité lumineuse typique: 10; Largeur (externe): 0.8; Longueur d'onde dominante: 639; Longueur d'onde, crête: 630; Longueur/hauteur: 1.6; Matière: AlGaAs; Nombre de broches: 2; Orientation de montage opto: Dessus; Orientation sortie de lumière: Top Emitting; Température de fonctionnement: -30°C à +85; Température de fonctionnement max..: 85; Température, stockage min.: -40; Température d'utilisation min: -30; Tension, Vf max..: 2.6; Tension, Vf min.: 2.1; Type de LED: Standard; Supplier 1: Farnell; Supplier Part Number 1: 8554641; RoHS: YES; Stock 1: 13902; Pricing 1: 5=0,06, 25=0,059, 100=0,057, 250=0,052, 500=0,047 (EUR); MSL: MSL 2A - 4 semaines; Couleur, LED: Rouge; Profondeur: 0.8; Température, stockage max..: 85; Tension, Vf typ.: 1.8; ComponentLink1URL: http://www.farnell.com/datasheets/313031.pdf; ComponentLink1Description: http://www.farnell.com/datasheets/313031.pdf; ComponentLink2URL: http://www.farnell.com/datasheets/55927.pdf; ComponentLink2Description: http://www.farnell.com/datasheets/55927.pdf
D6 = Bridge1: Full Wave Diode Bridge; Manufacturer: VISHAY GENERAL SEMICONDUCTOR; Manufacturer Part Number: GBU6B-E3/45; Nombre de phases: Une; Tension, Vrrm: 100; Courant, If moy.: 6; Tension, Vf max..: 1; Type de boîtier pont redresseur: GBU; Nombre de broches: 4; Diode Mounting Type: Traversant; Température d'utilisation min: -55; Température de fonctionnement max..: 150; Configuration diode: Double; Courant, Ifs max.: 175; Diode Type: Pont redresseur, monophasé; Hauteur: 18.8; Inflammabilité: UL; Largeur (externe): 22.3; Marquage composant: GBU6; Profondeur: 3.56; Température de fonctionnement: -55°C à +150; Température, Ta: 40; Tension, entrée: 70; Type de borne: Wire lead; Supplier 1: Farnell; Supplier Part Number 1: 9549480; RoHS: YES; Pricing 1: 1=0,53, 25=0,51, 100=0,5, 1000=0,49 (EUR); Courant, sortie max.: 6; Hauteur corps max..: 18.8; Longueur/hauteur: 18.8; Tension, entrée efficace: 70; Type de boîtier: GBU; ComponentLink1URL: http://www.vishay.com/doc?88615; ComponentLink1Description: http://www.vishay.com/doc?88615
D7 = D Schottky: Schottky Diode; Manufacturer: VISHAY; Manufacturer Part Number: SS3P4-M3/84A; Configuration diode: Une; Tension, Vrrm: 40; Courant, If moy.: 3; Tension, Vf max..: 600; Courant, Ifs max.: 50; Température d'utilisation min: -55; Température de fonctionnement max..: 150; Type de boîtier diode: SMP; Nombre de broches: 2; Température de fonctionnement: -55°C à +150; Published: 8-Jun-2000; LatestRevisionDate: 17-Jul-2002; LatestRevisionNote: Re-released for DXP Platform.; PackageReference: SMB; Publisher: Altium Limited; PackageDescription: DO-214-AA/SMB; 2 C-Bend Leads; Body 5.3 x 3.6 mm, inc. leads (LxW); Code_JEDEC: DO-214-AA; Supplier 1: Farnell; Supplier Part Number 1: 1812492; RoHS: YES; Pricing 1: 1=0,25, 25=0,21, 100=0,192, 250=0,188, 500=0,183 (EUR); Diode Type: Schottky; ComponentLink1URL: http://www.vishay.com/docs/88954/ss3p4.pdf; ComponentLink1Description: http://www.vishay.com/docs/88954/ss3p4.pdf
F1 = Fuse 2: Fuse; Manufacturer: KEYSTONE; Manufacturer Part Number: 4527; Fusible 5X20: 1123209; Published: 8-Jun-2000; LatestRevisionDate: 17-Jul-2002; LatestRevisionNote: Re-released for DXP Platform.; PackageReference: PIN-W2/E2.8; Publisher: Altium Limited; PackageDescription: Thru-Hole; 2 Leads; Supplier 1: Farnell; Supplier Part Number 1: 2301274+2301275+1123183; RoHS: YES; Pricing 1: 1=0,59, 250=0,45, 500=0,4, 1000=0,36, 5000=0,33 (EUR); ComponentLink1URL: http://www.keyelco.com/userAssets/file/M60p42.pdf; ComponentLink1Description: http://www.keyelco.com/userAssets/file/M60p42.pdf
L1 = Inductor: Manufacturer: MULTICOMP; Manufacturer Part Number: MCBFS7330-221MU; Gamme de produit: MULTICOMP - MCB Series; Inductance: 220; Tolérance d'Inductance: ± 20%; Construction inductance: Blindé; Résistance DC max.: 0.47; Courant efficace (Irms): 1.2; Type de packaging: Bande découpée; Largeur (externe): 15.24; Longueur/hauteur: 18.54; Nombre de broches: 2; Pas: 12.7; Profondeur: 7.62; Série: MCB<!--FANDB--><div class="features-and-benefits-container"></div>; Supplier 1: Farnell; Supplier Part Number 1: 1864291; RoHS: YES; Stock 1: 2348; Pricing 1: 5=0,37, 50=0,32, 100=0,27, 500=0,25, 1000=0,22 (EUR); Dimensions Boîtier: 18.54mm x 15.24mm x 7.62; ComponentLink1URL: http://www.farnell.com/datasheets/1684913.pdf; ComponentLink1Description: http://www.farnell.com/datasheets/1684913.pdf
P3 = Header 4: Header, 4-Pin; LatestRevisionDate: 17-Jul-2002; LatestRevisionNote: Re-released for DXP Platform.; Publisher: Altium Limited
P8 = Header 3: Header, 3-Pin; Manufacturer: TE CONNECTIVITY / BUCHANAN; Manufacturer Part Number: 796636-3; LatestRevisionDate: 17-Jul-2002; LatestRevisionNote: Re-released for DXP Platform.; Publisher: Altium Limited; Supplier 1: Farnell; Supplier Part Number 1: 2059780; RoHS: YES; Pricing 1: 10=0,68, 100=0,51, 500=0,43, 1000=0,36, 2000=0,35, 5000=0,33 (EUR); ComponentLink1URL: http://www.farnell.com/cad/1652960.pdf; ComponentLink1Description: http://www.farnell.com/cad/1652960.pdf; ComponentLink2URL: http://www.farnell.com/datasheets/1650926.pdf; ComponentLink2Description: http://www.farnell.com/datasheets/1650926.pdf
P9 = Header 3X2: Header, 3-Pin, Dual row; Manufacturer: TE CONNECTIVITY / AMP; Manufacturer Part Number: 1241050-3; LatestRevisionDate: 17-Jul-2002; LatestRevisionNote: Re-released for DXP Platform.; Publisher: Altium Limited; Supplier 1: Farnell; Supplier Part Number 1: 9689567; RoHS: YES; Pricing 1: 1=1,26, 10=1,22, 50=1,2, 100=1,16 (EUR); ComponentLink1URL: http://www.tycoelectronics.com/commerce/DocumentDelivery/DDEController?Action=srchrtrv&DocNm=1241050-3&DocType=Customer+View+Model&DocLang=English; ComponentLink1Description: http://www.tycoelectronics.com/commerce/DocumentDelivery/DDEController?Action=srchrtrv&DocNm=1241050-3&DocType=Customer+View+Model&DocLang=English; ComponentLink2URL: http://www.te.com/commerce/DocumentDelivery/DDEController?Action=showdoc&DocId=Customer+Drawing%7F1241050%7FA9%7Fpdf%7FEnglish%7FENG_CD_1241050_A9.pdf%7F1241050-5; ComponentLink2Description: http://www.te.com/commerce/DocumentDelivery/DDEController?Action=showdoc&DocId=Customer+Drawing%7F1241050%7FA9%7Fpdf%7FEnglish%7FENG_CD_1241050_A9.pdf%7F1241050-5; ComponentLink3URL: http://www.farnell.com/datasheets/318453.pdf; ComponentLink3Description: http://www.farnell.com/datasheets/318453.pdf
P11 P22 = Header 2: Header, 2-Pin; Manufacturer: HARWIN; Manufacturer Part Number: M20-8770242; Product Range: HARWIN - M20-87 Series; Terminaison du contact: PCB; Genre: Connecteur mâle; Nombre de contacts: 2; Nombre de rangées: 1; Pas: 2.54; Plaquage du contact: Or; Matériau du contact: Laiton; SVHC: No SVHC (20-Jun-2013); LatestRevisionDate: 17-Jul-2002; LatestRevisionNote: Re-released for DXP Platform.; Publisher: Altium Limited; Supplier 1: Farnell; Supplier Part Number 1: 1895211; RoHS: YES; Pricing 1: 10=0,137, 20=0,136, 50=0,135, 100=0,133, 250=0,128, 500=0,12 (EUR); ComponentLink1URL: http://www.farnell.com/cad/1330190.pdf; ComponentLink1Description: http://www.farnell.com/cad/1330190.pdf
R26 R28 R33 = Resistor 0805 1K: as R21 on sheet RS485 main; Supplier 1: Farnell; RoHS: YES; Pricing 1: 5000=0,001 (EUR); MSL: MSL 1 - Illimité; ComponentLink1URL: http://www.farnell.com/datasheets/1716700.pdf; ComponentLink1Description: http://www.farnell.com/datasheets/1716700.pdf; Supplier Part Number 1: 2129113
R27 = Resistor 0805 270: Resistor; Manufacturer: MULTICOMP; Manufacturer Part Number: MC01W08051270R; Product Range: MULTICOMP - MC Series; Puissance: 100; Tolérance de résistance: ± 1%; Type de boîtier de résistance: 0805; Type de résistance: Couche épaisse; Coefficient de température: ± 100; Tension: 150; Type de packaging: Full Reel; SVHC: No SVHC (20-Jun-2013); Resistor Mounting: CMS; Supplier 1: Farnell; RoHS: YES; Pricing 1: 5000=0,001 (EUR); Résistance: 270; MSL: (Non Applicable); ComponentLink1URL: http://www.farnell.com/datasheets/1729047.pdf; ComponentLink1Description: http://www.farnell.com/datasheets/1729047.pdf; Supplier Part Number 1: 2129067
U4 = LM1117DT-5.0: 800mA Low-Dropout Linear Regulator, 3-pin TO-252; Manufacturer: NXP; Manufacturer Part Number: NX1117C50Z; Tension d'entrée primaire: 20; Tension de sortie fixe: 5; Tension, déclenchement: 1.07; Type de boîtier CI régulateur de tension: SOT-223; Nombre de broches: 4; Courant, sortie: 800; Température d'utilisation min: -40; Température de fonctionnement max..: 125; SVHC: No SVHC (20-Jun-2013); Température de fonctionnement: -40°C à +125; Supplier 1: Farnell; Supplier Part Number 1: 2057275; RoHS: YES; Pricing 1: 1=0,36, 10=0,29, 100=0,26, 250=0,24, 500=0,22 (EUR); MSL: (Non Disponible); ComponentLink1URL: http://www.nxp.com/documents/data_sheet/NX1117C_NX1117CE_SER.pdf; ComponentLink1Description: http://www.nxp.com/documents/data_sheet/NX1117C_NX1117CE_SER.pdf; ComponentLink2URL: http://www.farnell.com/cad/1722034.zip; ComponentLink2Description: http://www.farnell.com/cad/1722034.zip
U5 = LM1117DT-3.3: 800mA Low-Dropout Linear Regulator, 3-pin TO-252; Manufacturer: DIODES INC.; Manufacturer Part Number: AP1117D33G-13; Tension d'entrée primaire: 18; Tension de sortie fixe: 3.3; Tension, déclenchement: 1.3; Nombre de broches: 3; Courant, sortie: 1; Température d'utilisation min: 0; Température de fonctionnement max..: 125; SVHC: No SVHC (19-Dec-2012); Racine de la référence: 1117; Température de fonctionnement: 0°C à +125; Supplier 1: Farnell; Supplier Part Number 1: 1825285; RoHS: YES; Stock 1: 2493; Pricing 1: 1=0,23, 10=0,21, 100=0,19, 250=0,181, 500=0,163 (EUR); Type de boîtier CI régulateur de tension: TO-252; Tension, sortie: 3.3; ComponentLink1URL: http://www.farnell.com/datasheets/608751.pdf; ComponentLink1Description: http://www.farnell.com/datasheets/608751.pdf
U6 = LM2576HVT-12: SIMPLE SWITCHER® 3A Step-Down Voltage Regulator, 5-pin TO-220; Manufacturer: TEXAS INSTRUMENTS; Manufacturer Part Number: LM2576HVS-12/NOPB; Tension d'entrée primaire: 60; Nombre de canaux de sortie: 1; Tension, sortie: 12; Courant, sortie: 3; Type de boîtier CI régulateur de tension: TO-263; Nombre de broches: 5; Température d'utilisation min: -40; Température de fonctionnement max..: 125; SVHC: No SVHC (20-Jun-2013); Racine de la référence: 2576; Température de fonctionnement: -40°C à +125; Supplier 1: Farnell; Supplier Part Number 1: 2115115; RoHS: YES; Pricing 1: 1=4,23, 10=3,19, 100=2,48, 250=2,41, 500=2,35 (EUR); MSL: MSL 3 - 168 heures; ComponentLink1URL: http://www.farnell.com/datasheets/1520137.pdf; ComponentLink1Description: http://www.farnell.com/datasheets/1520137.pdf

## Sheet USB HOST.SchDoc: USB HOST
size A4; Date: 30 08 2013; Author: Rachid AKKOUCHE; CompanyName: MDI; DrawnBy: Rachid AKKOUCHE; Engineer: Rachid AKKOUCHE; Organization: RASoftware; Address1: 52 J03, rue de la crèche; Address2: 77100 MEAUX; Address3: FRANCE; DocumentNumber: BRA201308309C; Revision: C; SheetNumber: 9; SheetTotal: 11; Telephone: +33651604047; Email: rachid.akkouche@wanadoo.fr; Proprietaire: MDI System; Dessinepar: -; Verifiepar: -; Time: 19:00
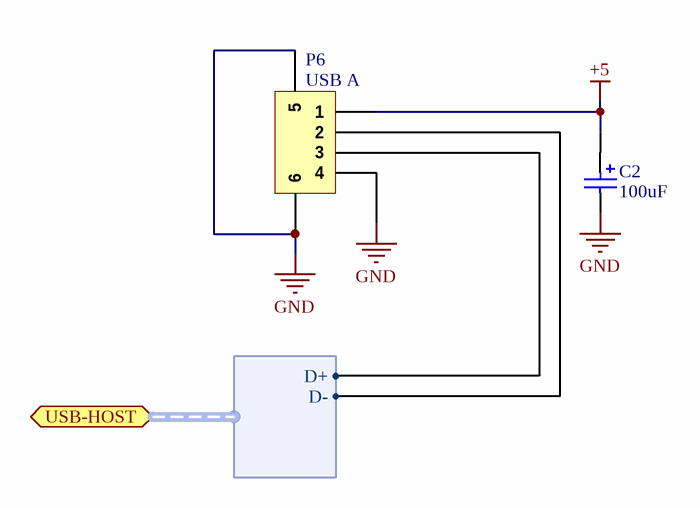
[diagram p6: USB HOST.SchDoc]

### Parts
C2  100uF  [Kemet_63]
P6  USB A  [USB  2410 06]

### Ports
USB-HOST (harness USB-HOST)

### Harnesses
USB-HOST: D-, D+

### Nets
+5: C2.1 P6.1
GND: C2.2 P6.4 P6.5 P6.6
D_N: P6.2 ; port USB-HOST.D-
D_P: P6.3 ; port USB-HOST.D+

### Notes on the sheet
- Ce document est la propriété de
- Project:
- Il ne peut être divulgué sans l'accord écrit de l'un de ses représentants dûment mandaté
- Title:
- Number:
- Date:
- Time:
- Size:
- A4
- Revision:
- Sheet
- of
- 52 J03 rue de la crèche
- Draw by:
- 77100 Meaux

### Library data of the parts
C2 = Cap Pol 100uF: as C10 on sheet PSU; Supplier 1: Farnell; RoHS: YES; Pricing 1: 10=0,123, 50=0,095, 100=0,078, 250=0,07, 1000=0,062 (EUR); Courant d'ondulation c.a. à  100Hz: 300; Fréquence, impédance: 100; Longueur/hauteur: 7.7; Température, courant ondulatoire: 105; Température, impédance: 20; ComponentLink1URL: http://www.epcos.com/inf/20/30/db/alu_x/B41142.pdf; ComponentLink1Description: http://www.epcos.com/inf/20/30/db/alu_x/B41142.pdf; Supplier Part Number 1: 1735328
P6 = Header 4_1: USB 2.0 Connector A; Manufacturer: LUMBERG; Manufacturer Part Number: 2410 06; Type de connecteur: USB Type A; Série: 2410; Genre: Embase; Nombre de contacts: 4; Terminaison du contact: A souder; Montage connecteur: CI; Plaquage du contact: Or; Matériau du contact: Cuivre; SVHC: No SVHC (19-Dec-2012); Body Plating: Etain; Courant: 1; Montage, orientation: 90°; Nombre de cycles d'accouplements: 1500; Plaquage borne: Tin; Résistance, contact: 30; Température de fonctionnement max..: +105; Température d'utilisation min: -55; Tension, vérification: 750; Type de montage: Montage en surface; Supplier 1: Farnell; Supplier Part Number 1: 1308874; RoHS: YES; Pricing 1: 1=0,63, 10=0,53, 50=0,51, 100=0,48 (EUR); Contact Material: CuSn; Tension c.a.: 30; ComponentLink1URL: http://www.farnell.com/datasheets/1715380.pdf; ComponentLink1Description: http://www.farnell.com/datasheets/1715380.pdf

## Sheet USB OTG.SchDoc: USG OTG
size A4; Date: 30 08 2013; Author: Rachid AKKOUCHE; CompanyName: MDI; DrawnBy: Rachid AKKOUCHE; Engineer: Rachid AKKOUCHE; Organization: RASoftware; Address1: 52 J03, rue de la crèche; Address2: 77100 MEAUX; Address3: FRANCE; DocumentNumber: BRA2013083010C; Revision: C; SheetNumber: 10; SheetTotal: 11; Telephone: +33651604047; Email: rachid.akkouche@wanadoo.fr; Proprietaire: MDI System; Dessinepar: -; Verifiepar: -; Time: 19:30
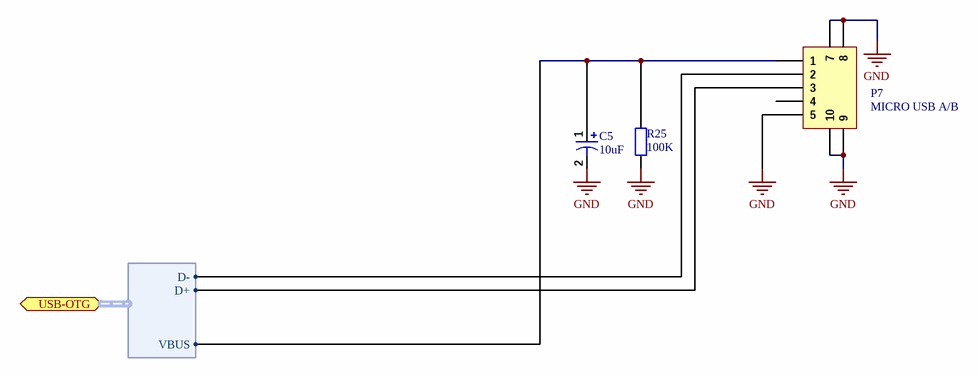
[diagram p7: USB OTG.SchDoc]

### Parts
C5  10uF  [KEMET_4]
P7  MICRO USB A/B  [USB FCI 10104111]
R25  100K  [R0805]

### Ports
USB-OTG (harness USG-OTG)

### Harnesses
USG-OTG: D-, D+, VBUS

### Nets
GND: C5.2 P7.5 P7.7 P7.8 P7.9 P7.10 R25.1
D_N: P7.2 ; port USB-OTG.D-
D_P: P7.3 ; port USB-OTG.D+
VBUS: C5.1 P7.1 R25.2 ; port USB-OTG.VBUS

Not connected (* = marked no-connect by the designer): P7 4

### Notes on the sheet
- Ce document est la propriété de
- Project:
- Il ne peut être divulgué sans l'accord écrit de l'un de ses représentants dûment mandaté
- Title:
- Number:
- Date:
- Time:
- Size:
- A4
- Revision:
- Sheet
- of
- 52 J03 rue de la crèche
- Draw by:
- 77100 Meaux

### Library data of the parts
C5 = Cap Pol1: as C7 on sheet PSU; Supplier 1: Farnell; Supplier Part Number 1: 2069174; RoHS: YES; Pricing 1: 10=0,111, 100=0,085, 500=0,074, 1000=0,07, 5000=0,066 (EUR); ComponentLink1URL: http://www.farnell.com/datasheets/1500293.pdf; ComponentLink1Description: http://www.farnell.com/datasheets/1500293.pdf
P7 = Header 5: Header, 5-Pin; Manufacturer: FCI; Manufacturer Part Number: 10104111-0001LF; Type de connecteur: USB Micro A/B; Série: 10104111; Genre: Embase; Nombre de contacts: 5; Terminaison du contact: Montage en surface à angle droit; Montage connecteur: CI; Plaquage du contact: Or; Matériau du contact: Cuivre; SVHC: No SVHC (20-Jun-2013); LatestRevisionDate: 17-Jul-2002; LatestRevisionNote: Re-released for DXP Platform.; Publisher: Altium Limited; Supplier 1: Farnell; Supplier Part Number 1: 2293755; RoHS: YES; Pricing 1: 1=0,98, 10=0,84, 25=0,76, 50=0,67, 100=0,64, 250=0,57 (EUR); ComponentLink1URL: http://portal.fciconnect.com/Comergent//fci/drawing/10104111.pdf; ComponentLink1Description: http://portal.fciconnect.com/Comergent//fci/drawing/10104111.pdf
R25 = Resistor 0805 100K: Resistor; Manufacturer: MULTICOMP; Manufacturer Part Number: MC0.1W08051%100KFR; Product Range: MULTICOMP - MC Series; Résistance: 100; Tolérance de résistance: ± 1%; Type de boîtier de résistance: 0805; Type de résistance: Couche épaisse; Coefficient de température: ± 100; Tension: 150; Type de packaging: Full Reel; Resistor Mounting: CMS; Supplier 1: Farnell; Supplier Part Number 1: 2129276; RoHS: YES; Pricing 1: 5000=0,001 (EUR); Puissance: 100; MSL: MSL 1 - Illimité; ComponentLink1URL: http://www.farnell.com/datasheets/1716700.pdf; ComponentLink1Description: http://www.farnell.com/datasheets/1716700.pdf